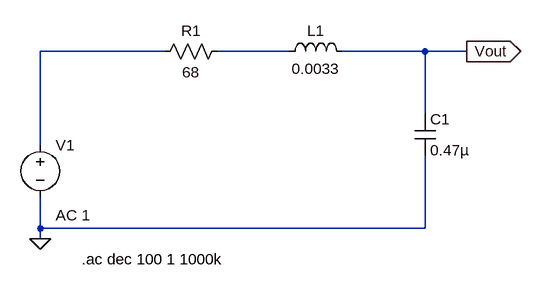
[diagram p0: schematic LPF_circuit.asc]
LPF_circuit.asc, the LTspice schematic file:
Version 4
SHEET 1 880 680
WIRE 272 0 80 0
WIRE 464 0 352 0
WIRE 672 0 544 0
WIRE 736 0 672 0
WIRE 672 96 672 0
WIRE 80 144 80 0
WIRE 80 272 80 224
WIRE 672 272 672 160
WIRE 672 272 80 272
WIRE 80 288 80 272
FLAG 80 288 0
FLAG 736 0 Vout
IOPIN 736 0 Out
SYMBOL voltage 80 128 R0
WINDOW 123 24 124 Left 2
WINDOW 39 0 0 Left 0
SYMATTR InstName V1
SYMATTR Value ""
SYMATTR Value2 AC 1
SYMBOL res 368 -16 R90
WINDOW 0 0 56 VBottom 2
WINDOW 3 32 56 VTop 2
SYMATTR InstName R1
SYMATTR Value 68
SYMBOL ind 448 16 R270
WINDOW 0 32 56 VTop 2
WINDOW 3 5 56 VBottom 2
SYMATTR InstName L1
SYMATTR Value 0.0033
SYMBOL cap 656 96 R0
SYMATTR InstName C1
SYMATTR Value 0.47µ
TEXT 144 320 Left 2 !.ac dec 100 1 1000k

The netlist it stands for:
* LPF_circuit.asc
V1 N001 0 AC 1
R1 N002 N001 68
L1 N002 Vout 0.0033
C1 Vout 0 0.47µ
.ac dec 100 1 1000k
.backanno
.end